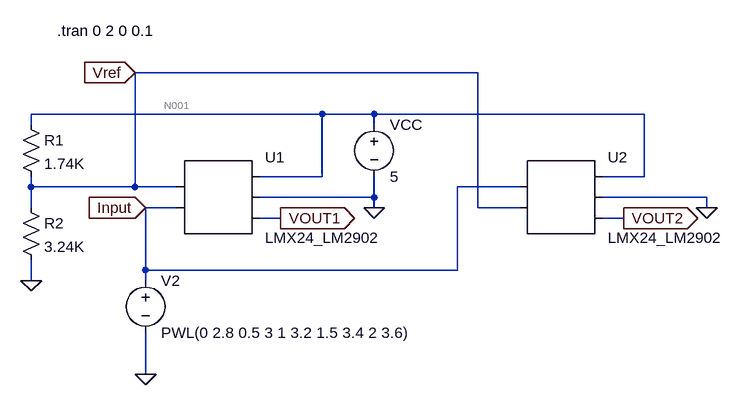
[diagram p0: schematic LMx58_LM2904.asc]
* LMx58_LM2904.asc
* U1: LMX24_LM2902 (symbol AutoGenerated\LMX24_LM2902 not available, pins judged from their places): pin1=Vref pin2=Input pin3=N001 pin4=0 pin5=VOUT1
VCC N001 0 5
R1 N001 Vref 1.74K
R2 Vref 0 3.24K
V2 Input 0 PWL(0 2.8 0.5 3 1 3.2 1.5 3.4 2 3.6)
* U2: LMX24_LM2902 (symbol AutoGenerated\LMX24_LM2902 not available, pins judged from their places): pin1=Input pin2=Vref pin3=N001 pin4=0 pin5=VOUT2
.tran 0 2 0 0.1
.backanno
.end

* Results of the author's LTspice run, read from the files saved beside the schematic
* Operating Point, zero values left out:
*   V(vout1) = 3.831 V
*   V(n001) = 5 V
*   V(input) = 2.8 V
*   V(vref) = 3.253 V
*   V(vout2) = 23.79 mV
*   I(R2) = 1.004 mA
*   I(R1) = 1.004 mA
*   I(V2) = 37.99 nA
*   I(Vcc) = -1.354 mA
*   Ix(u1:IN+) = -20 nA
*   Ix(u1:IN-) = -18 nA
*   Ix(u1:VCC) = 175 µA
*   Ix(u1:VEE) = -175 µA
*   Ix(u2:IN+) = -20 nA
*   Ix(u2:IN-) = -18 nA
*   Ix(u2:VCC) = 175 µA
*   Ix(u2:VEE) = -175 µA
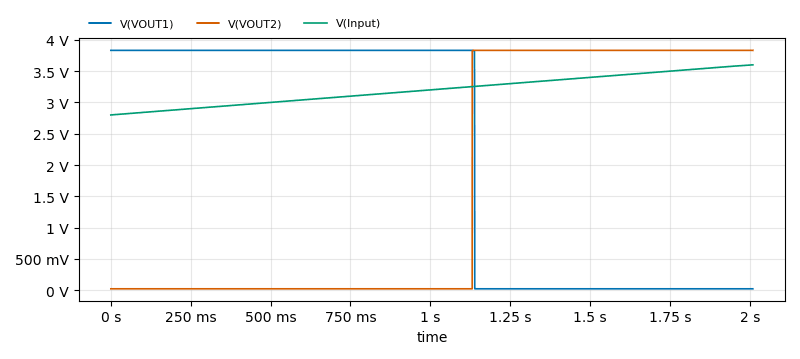
[diagram p1: Transient Analysis of LMx58_LM2904.asc, plotted from the saved traces]
* Transient Analysis, 1 run:
*   V(VOUT1): min 23.79 mV, max 3.831 V, average 2.181 V, rms 2.884 V, last 23.79 mV
*   V(VOUT2): min 23.79 mV, max 3.831 V, average 1.688 V, rms 2.533 V, last 3.831 V
*   V(Input): min 2.8 V, max 3.6 V, average 3.202 V, rms 3.214 V, last 3.6 V